# Altium schematic sheet FPGA_TSK52_I2C_Wishbone.SchDoc
size A3; DocumentNumber: 1; SheetNumber: 1; SheetTotal: 2; Address1: L3, 12a Rodborough Rd; Address2: Frenchs Forest; Address3: NSW; Address4: Australia 2086; Organization: Altium Limited
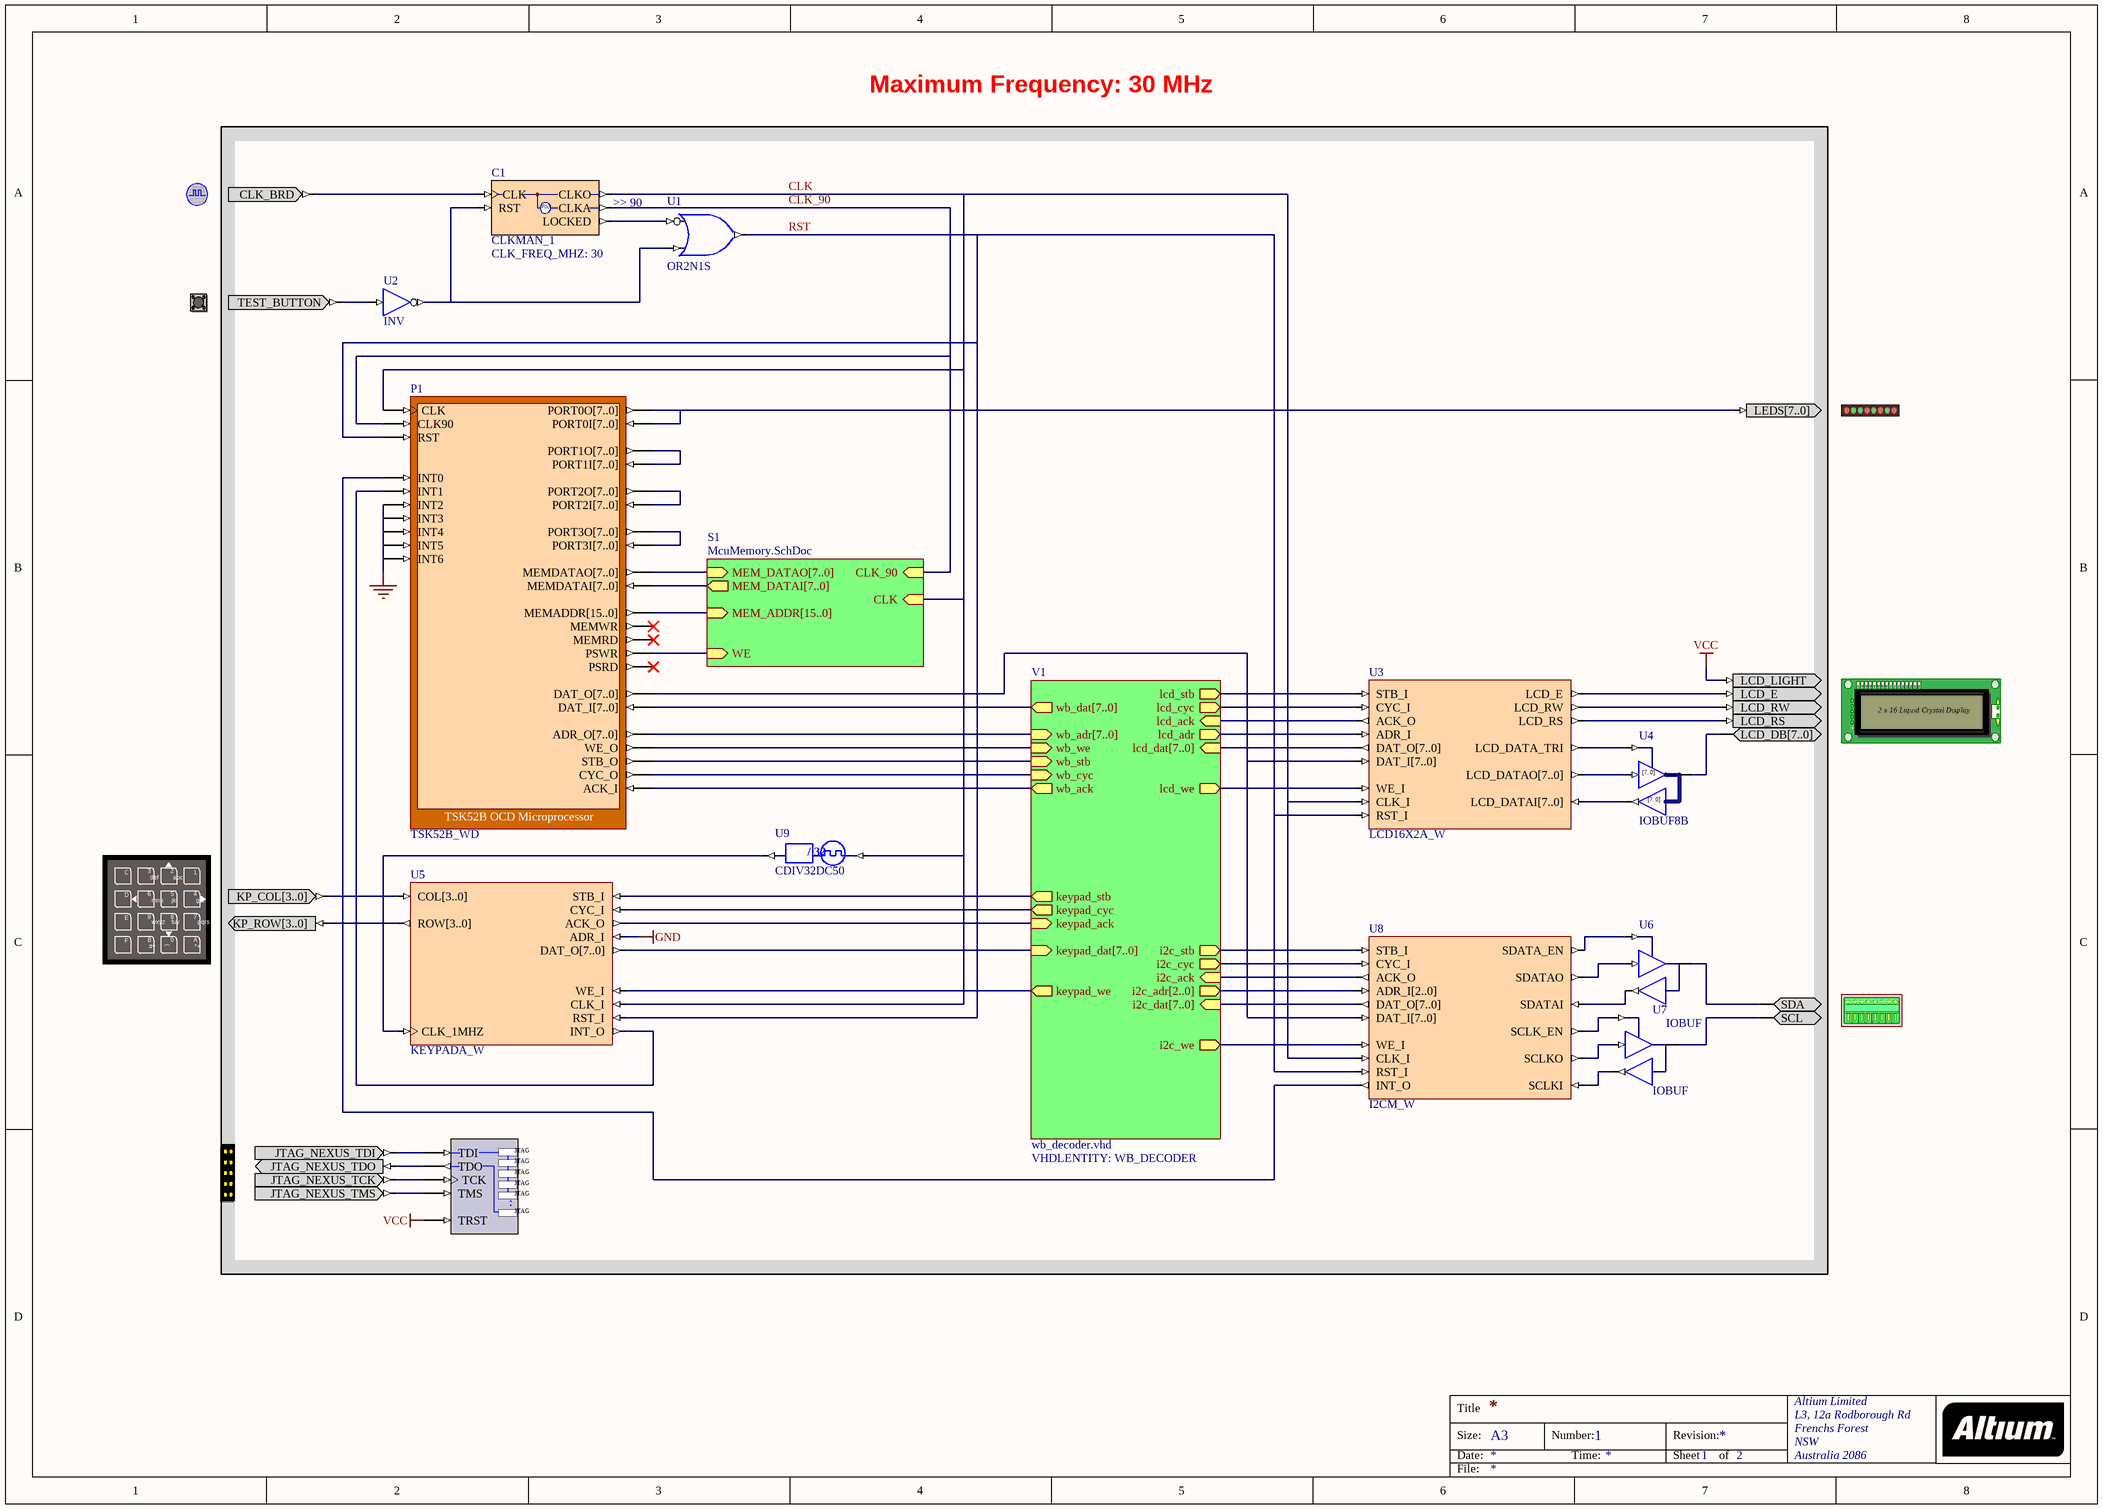
[diagram p0: FPGA_TSK52_I2C_Wishbone.SchDoc]

## Parts
(Parts that share a designator on the sheet are numbered #1, #2 ... from top to bottom, then left to right.)
?#1  CLOCK_BOARD  (value not drawn)
?#2  TEST_BUTTON  (value not drawn)
?#3  LED  (value not drawn)
?#4  LCD  (value not drawn)
?#5  KEYPAD  (value not drawn)
?#6  ADCDAC_I2C  (value not drawn)
?#7  NEXUS_JTAG_CONNECTOR  (value not drawn)
C1  CLKMAN_1  CLK_FREQ_MHZ: 30  ClkA_Operation: >> 90
NEXUS_JTAG_PORT  NEXUS_JTAG_PORT  (value not drawn)
P1  TSK52B_WD
U1  OR2N1S
U2  INV
U3  LCD16X2A_W
U4  IOBUF8B
U5  KEYPADA_W
U6  IOBUF
U7  IOBUF
U8  I2CM_W
U9  CDIV32DC50

## Sub-sheets
S1 = McuMemory.SchDoc: MEM_ADDR[15..0] (in), MEM_DATAI[7..0] (out), MEM_DATAO[7..0] (in), WE (in), CLK (in), CLK_90 (in)
V1 = wb_decoder.vhd: i2c_ack (in), i2c_adr[2..0] (out), i2c_cyc (out), i2c_dat[7..0] (in), i2c_stb (out), i2c_we (out), lcd_ack (in), lcd_adr (out), lcd_cyc (out), lcd_dat[7..0] (in), lcd_stb (out), lcd_we (out), wb_ack (out), wb_adr[7..0] (in), wb_cyc (in), wb_dat[7..0] (out), wb_stb (in), wb_we (in), keypad_cyc (out), keypad_stb (out), keypad_we (out), keypad_dat[7..0] (in), keypad_ack (in)  | VHDLENTITY: WB_DECODER

## Nets
GND: P1.INT2 P1.INT3 P1.INT4 P1.INT5 P1.INT6 U5.ADR_I
VCC: ?#4.LCD_LIGHT NEXUS_JTAG_PORT.TRST
CLK: C1.CLKO P1.CLK U3.CLK_I U5.CLK_I U8.CLK_I U9.CLKIN ; sheet S1/CLK
CLK_90: C1.CLKA P1.CLK90 ; sheet S1/CLK_90
RST: P1.RST U1.O U3.RST_I U5.RST_I U8.RST_I
Net?#1_CLK_BRD: ?#1.CLK_BRD C1.CLK
Net?#2_TEST_BUTTON: ?#2.TEST_BUTTON U2.I
Net?#3_LEDS[7..0]: ?#3.LEDS[7..0] P1.PORT0I[7..0] P1.PORT0O[7..0]
Net?#4_LCD_DB[7..0]: ?#4.LCD_DB[7..0] U4.IO[7..0]
Net?#4_LCD_E: ?#4.LCD_E U3.LCD_E
Net?#4_LCD_RS: ?#4.LCD_RS U3.LCD_RS
Net?#4_LCD_RW: ?#4.LCD_RW U3.LCD_RW
Net?#5_KP_COL[3..0]: ?#5.KP_COL[3..0] U5.COL[3..0]
Net?#5_KP_ROW[3..0]: ?#5.KP_ROW[3..0] U5.ROW[3..0]
Net?#6_SCL: ?#6.SCL U7.IO
Net?#6_SDA: ?#6.SDA U6.IO
Net?#7_JTAG_NEXUS_TCK: ?#7.JTAG_NEXUS_TCK NEXUS_JTAG_PORT.TCK
Net?#7_JTAG_NEXUS_TDI: ?#7.JTAG_NEXUS_TDI NEXUS_JTAG_PORT.TDI
Net?#7_JTAG_NEXUS_TDO: ?#7.JTAG_NEXUS_TDO NEXUS_JTAG_PORT.TDO
Net?#7_JTAG_NEXUS_TMS: ?#7.JTAG_NEXUS_TMS NEXUS_JTAG_PORT.TMS
NetC1_LOCKED: C1.LOCKED U1.I0
NetC1_RST: C1.RST U1.I1 U2.O
NetP1_ACK_I: P1.ACK_I ; sheet V1/wb_ack
NetP1_ADR_O[7..0]: P1.ADR_O[7..0] ; sheet V1/wb_adr[7..0]
NetP1_CYC_O: P1.CYC_O ; sheet V1/wb_cyc
NetP1_DAT_I[7..0]: P1.DAT_I[7..0] ; sheet V1/wb_dat[7..0]
NetP1_DAT_O[7..0]: P1.DAT_O[7..0] U3.DAT_I[7..0] U8.DAT_I[7..0]
NetP1_INT0: P1.INT0 U8.INT_O
NetP1_INT1: P1.INT1 U5.INT_O
NetP1_MEMADDR[15..0]: P1.MEMADDR[15..0] ; sheet S1/MEM_ADDR[15..0]
NetP1_MEMDATAI[7..0]: P1.MEMDATAI[7..0] ; sheet S1/MEM_DATAI[7..0]
NetP1_MEMDATAO[7..0]: P1.MEMDATAO[7..0] ; sheet S1/MEM_DATAO[7..0]
NetP1_PORT1I[7..0]: P1.PORT1I[7..0] P1.PORT1O[7..0]
NetP1_PORT2I[7..0]: P1.PORT2I[7..0] P1.PORT2O[7..0]
NetP1_PORT3I[7..0]: P1.PORT3I[7..0] P1.PORT3O[7..0]
NetP1_PSWR: P1.PSWR ; sheet S1/WE
NetP1_STB_O: P1.STB_O ; sheet V1/wb_stb
NetP1_WE_O: P1.WE_O ; sheet V1/wb_we
NetU3_ACK_O: U3.ACK_O ; sheet V1/lcd_ack
NetU3_ADR_I: U3.ADR_I ; sheet V1/lcd_adr
NetU3_CYC_I: U3.CYC_I ; sheet V1/lcd_cyc
NetU3_DAT_O[7..0]: U3.DAT_O[7..0] ; sheet V1/lcd_dat[7..0]
NetU3_LCD_DATA_TRI: U3.LCD_DATA_TRI U4.T
NetU3_LCD_DATAI[7..0]: U3.LCD_DATAI[7..0] U4.O[7..0]
NetU3_LCD_DATAO[7..0]: U3.LCD_DATAO[7..0] U4.I[7..0]
NetU3_STB_I: U3.STB_I ; sheet V1/lcd_stb
NetU3_WE_I: U3.WE_I ; sheet V1/lcd_we
NetU5_ACK_O: U5.ACK_O ; sheet V1/keypad_ack
NetU5_CLK_1MHZ: U5.CLK_1MHZ U9.CLKDV
NetU5_CYC_I: U5.CYC_I ; sheet V1/keypad_cyc
NetU5_DAT_O[7..0]: U5.DAT_O[7..0] ; sheet V1/keypad_dat[7..0]
NetU5_STB_I: U5.STB_I ; sheet V1/keypad_stb
NetU5_WE_I: U5.WE_I ; sheet V1/keypad_we
NetU6_I: U6.I U8.SDATAO
NetU6_O: U6.O U8.SDATAI
NetU6_T: U6.T U8.SDATA_EN
NetU7_I: U7.I U8.SCLKO
NetU7_O: U7.O U8.SCLKI
NetU7_T: U7.T U8.SCLK_EN
NetU8_ACK_O: U8.ACK_O ; sheet V1/i2c_ack
NetU8_ADR_I[2..0]: U8.ADR_I[2..0] ; sheet V1/i2c_adr[2..0]
NetU8_CYC_I: U8.CYC_I ; sheet V1/i2c_cyc
NetU8_DAT_O[7..0]: U8.DAT_O[7..0] ; sheet V1/i2c_dat[7..0]
NetU8_STB_I: U8.STB_I ; sheet V1/i2c_stb
NetU8_WE_I: U8.WE_I ; sheet V1/i2c_we

Not connected (* = marked no-connect by the designer): P1 MEMRD* MEMWR* PSRD*

## Notes on the sheet
- Maximum Frequency: 30 MHz
- Title
- Size:
- Date:
- A3
- Number:
- Time:
- Revision:
- Sheet
- of
- File:
- (in symbol CDIV32DC50) / 32
- (in symbol CLKMAN_1) F(x)
- (in symbol IOBUF8B) [7..0]
- (in symbol KEYPAD) C; 3; 2; 1; def; abc; 6; 5; 4; D; mno; jkl; ghi; E; 9; 8; 7; wxyz; tuv; pqrs; F; B; 0; A; #^; (; *+
- (in symbol LCD) 2 x 16 Liquid Crystal Display
- (in symbol NEXUS_JTAG_PORT) JTAG; .

## Library data of the parts
?#1 = CLOCK_BOARD: Global System Clock Supply; PortComponent: True; Published: 19-Nov-2003; Publisher: Altium Limited
?#2 = TEST_BUTTON: Test Button; PortComponent: True; Published: 19-Nov-2003; Publisher: Altium Limited
?#3 = LED: 8-Way LEDS; PortComponent: True; Published: 19-Nov-2003; Publisher: Altium Limited
?#4 = LCD: Liquid Crystal Display; PortComponent: True; Published: 19-Nov-2003; Publisher: Altium Limited
?#5 = KEYPAD: Key Pad; PortComponent: True; Published: 19-Nov-2003; Publisher: Altium Limited
?#6 = ADCDAC_I2C: Analog Digital/ Digital Analog Converter, I2C Interface; PortComponent: True; Published: 19-Nov-2003; Publisher: Altium Limited
?#7 = NEXUS_JTAG_CONNECTOR: JTAG Port; PortComponent: True; Published: 19-Nov-2003; Publisher: Altium Limited
C1 = CLKMAN_1: Single Operational Output Clock Manager; Clk_Count: 1; Published: 5-Jul-2004; Publisher: Altium Limited; Core Revision: 1.00.00; Nexus_Core: ClockManager; HelpURL: CR0118 FPGA Generic Library Guide.pdf#page=148; Functional Class: Clock Manager; Port Size: 1
NEXUS_JTAG_PORT = NEXUS_JTAG_PORT: Soft Nexus-Chain Connector; NEXUS_JTAG_CONNECTOR: True; Published: 18-Dec-2003; Publisher: Altium Limited
P1 = TSK52B_WD: TSK52B OCD Microprocessor; NEXUS_CORE: Processor_OCDS; NEXUS_JTAG_DEVICE: True; NEXUS_JTAG_ORDER: 0; ChildModel1: TSK52B_WD_DRAM8X256; ChildCore1: M1; Published: 5/07/2004; Publisher: Altium Hobart Technology Centre; Core Revision: 1.00.00
U1 = OR2N1S: 2-Input OR Gate with Active Low A Input, Single Pin Version; Xilinx Equivalent: OR2B1; ArchiveName: GENERIC; VHDLIB_SIM: GENERIC_LIB; Published: 29-Jan-2004; Publisher: Altium Limited; Core Revision: 1.00.00
U2 = INV: Inverter; ArchiveName: GENERIC; VHDLIB_SIM: GENERIC_LIB; Published: 29-Jan-2004; Publisher: Altium Limited; Xilinx Equivalent: INV; Core Revision: 1.00.00
U3 = LCD16X2A_W: LCD Controller Wishbone; Published: 9-Dec-2004; Publisher: Altium Limited; ComponentLink1Description: Core &Resource Usage; ComponentLink1URL: CR0139 FPGA Peripheral Resource Usage.pdf#page=17; HelpURL: CR0107 LCD16X2 LCD Controller.pdf#page=2; LastRevisionNo: 1.00.00
U4 = IOBUF8B: 8-Bit Input/Output Buffer, Bus Version; ArchiveName: GENERIC; Published: 18-Dec-2003; Publisher: Altium Limited; Core Revision: 1.00.00
U5 = KEYPADA_W: Keypad Wishbone; Published: 9-Dec-2004; Publisher: Altium Limited; LastRevisionNo: 1.00.00; HelpURL: CR0106 Keypad Controller.pdf#page=2; ComponentLink1Description: Core &Resource Usage; ComponentLink1URL: CR0139 FPGA Peripheral Resource Usage.pdf#page=15
U6 U7 = IOBUF: Input/Output Buffer; ArchiveName: GENERIC; VHDLIB_SIM: GENERIC_LIB; Published: 29-Jan-2004; Publisher: Altium Limited; Xilinx Equivalent: IOBUF; Core Revision: 1.00.00
U8 = I2CM_W: I2C Master Wishbone; Published: 9-Dec-2004; Publisher: Altium Limited; ComponentLink1Description: Core &Resource Usage; ComponentLink1URL: CR0139 FPGA Peripheral Resource Usage.pdf#page=13; HelpURL: CR0105 I2CM Controller.pdf#page=2; LastRevisionNo: 1.00.00
U9 = CDIV32DC50: Clock Divider by 32 with 50% Duty Cycle Output; ArchiveName: GENERIC; VHDLIB_SIM: GENERIC_LIB; Published: 29-Jan-2004; Publisher: Altium Limited; Core Revision: 1.00.00